# Altium schematic sheet 5-Brake Temp Sensors.SchDoc
size A4
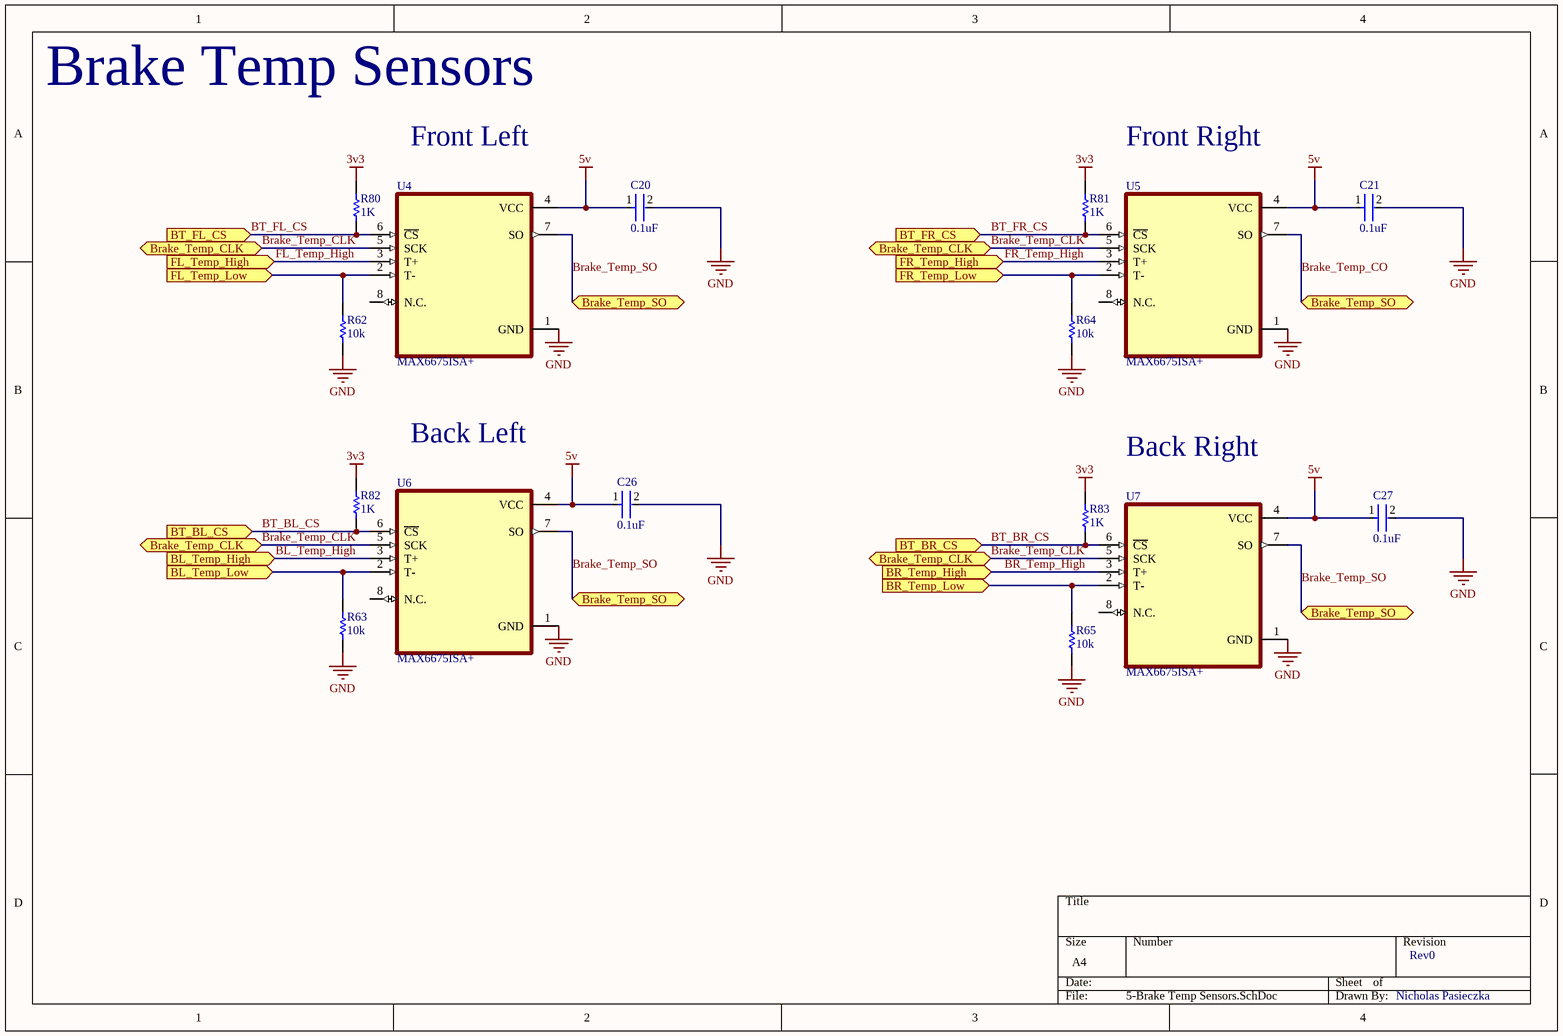
[diagram p0: 5-Brake Temp Sensors.SchDoc]

## Parts
C20  0.1uF  [FP-CL17-IPC_C]
C21  0.1uF  [FP-CL17-IPC_C]
C26  0.1uF  [FP-CL17-IPC_C]
C27  0.1uF  [FP-CL17-IPC_C]
R62  value 10k  [1608[0603]]  (hidden comment: Res1)
R63  value 10k  [1608[0603]]  (hidden comment: Res1)
R64  value 10k  [1608[0603]]  (hidden comment: Res1)
R65  value 10k  [1608[0603]]  (hidden comment: Res1)
R80  value 1K  [1608[0603]]  (hidden comment: Res1)
R81  value 1K  [1608[0603]]  (hidden comment: Res1)
R82  value 1K  [1608[0603]]  (hidden comment: Res1)
R83  value 1K  [1608[0603]]  (hidden comment: Res1)
U4  MAX6675ISA+  [SOIC127P600X175-8N]
U5  MAX6675ISA+  [SOIC127P600X175-8N]
U6  MAX6675ISA+  [SOIC127P600X175-8N]
U7  MAX6675ISA+  [SOIC127P600X175-8N]

## Ports
BL_Temp_High (in), BL_Temp_Low (in), BR_Temp_High (in), BR_Temp_Low (in), Brake_Temp_CLK (bidir), Brake_Temp_SO (bidir), BT_BL_CS (in), BT_BR_CS (in), BT_FL_CS (in), BT_FR_CS (in), FL_Temp_High (in), FL_Temp_Low (in), FR_Temp_High (in), FR_Temp_Low (in)

## Nets
3v3: R80.2 R81.2 R82.2 R83.2
5v: C20.1 C21.1 C26.1 C27.1 U4.4(VCC) U5.4(VCC) U6.4(VCC) U7.4(VCC)
GND: C20.2 C21.2 C26.2 C27.2 R62.1 R63.1 R64.1 R65.1 U4.1(GND) U5.1(GND) U6.1(GND) U7.1(GND)
BL_Temp_High: U6.3(T+) ; port BL_Temp_High
BL_Temp_Low: R63.2 U6.2(T-) ; port BL_Temp_Low
BR_Temp_High: U7.3(T+) ; port BR_Temp_High
BR_Temp_Low: R65.2 U7.2(T-) ; port BR_Temp_Low
Brake_Temp_CLK: U4.5(SCK) U5.5(SCK) U6.5(SCK) U7.5(SCK) ; port Brake_Temp_CLK
Brake_Temp_CO: U4.7(SO) U5.7(SO) U6.7(SO) U7.7(SO) ; port Brake_Temp_SO  [also labelled Brake_Temp_SO]
BT_BL_CS: R82.1 U6.6(~{CS}) ; port BT_BL_CS
BT_BR_CS: R83.1 U7.6(~{CS}) ; port BT_BR_CS
BT_FL_CS: R80.1 U4.6(~{CS}) ; port BT_FL_CS
BT_FR_CS: R81.1 U5.6(~{CS}) ; port BT_FR_CS
FL_Temp_High: U4.3(T+) ; port FL_Temp_High
FL_Temp_Low: R62.2 U4.2(T-) ; port FL_Temp_Low
FR_Temp_High: U5.3(T+) ; port FR_Temp_High
FR_Temp_Low: R64.2 U5.2(T-) ; port FR_Temp_Low

Not connected (* = marked no-connect by the designer): U4 8(N.C.); U5 8(N.C.); U6 8(N.C.); U7 8(N.C.)

## Notes on the sheet
- Brake Temp Sensors
- Front Left
- Front Right
- Back Left
- Back Right
- Rev0
- Nicholas Pasieczka

## Library data of the parts
C20 C21 C26 C27 = CMP-13271-001069-1: Cap Ceramic 100nF 10V X7R ±10% SMD 0402 +125°C Paper T/R; Height: 0.5mm; Case/Package: 0402; Contact Plating: Tin; Case Code (Imperial): 0402; Capacitance: 100nF; Thickness: 0.022inch; Min Operating Temperature: -55°C; Package Quantity: 1; Length: 1mm; Max Operating Temperature: 125°C; Depth: 0.5mm; Voltage Rating: 10V; Packaging: Tape and Reel; Mount: Surface Mount; Tolerance: 10%; Width: 0.02inch; Radiation Hardening: No; Case Code (Metric): 1005; Dielectric: X7R
R62-R65 = Res1: Resistor; Manufacturer: Yageo; Manufacturer Part Number: RC0603JR-0710KL; Tolerance: ±5%; Power (Watts): 0.1W, 1/10W; Temperature Coefficient: ±100ppm/°C; Supplier 1: Digi-Key; Supplier Part Number 1: 311-10KGRCT-ND; RoHS: RoHS Compliant; Category: Resistors; Stock 1: 2936292; Pricing 1: 1=0.16, 10=0.016, 25=0.0112, 50=0.0084, 100=0.0062, 250=0.0048, 500=0.00382, 1000=0.00281 (CAD); Packaging: Cut Tape (CT); Part Status: Active; Resistance (Ohms): 10k; Composition: Thick Film; Features: Moisture Resistant; Operating Temperature: -55°C ~ 155°C; Package / Case: 0603 (1608 Metric); Supplier Device Package: 0603; Size / Dimension: 0.063" L x 0.031" W (1.60mm x 0.80mm); Height - Seated (Max): 0.022" (0.55mm); Number of Terminations: 2; Failure Rate: -; ComponentLink1URL: http://www.yageo.com/NewPortal/yageodocoutput?fileName=/pdf/R-Chip/PYu-RC_Group_51_RoHS_L_4.pdf; ComponentLink1Description: http://www.yageo.com/NewPortal/yageodocoutput?fileName=/pdf/R-Chip/PYu-RC_Group_51_RoHS_L_4.pdf
R80-R83 = Res1: Resistor; Published: 8-Jun-2000; LatestRevisionDate: 17-Jul-2002; LatestRevisionNote: Re-released for DXP Platform.; PackageReference: AXIAL-0.3; Publisher: Altium Limited; PackageDescription: Axial Device, Thru-Hole; 2 Leads; 0.3 in Pin Spacing
U4-U7 = MAX6675ISA+: IC THERMOCOUP TO DGTL 8-SOIC; MF: Maxim Integrated; Package: SOIC-8 Maxim; Price: None; SnapEDA_Link: https://www.snapeda.com/parts/MAX6675ISA%2B/Maxim%20Integrated/view-part/213937/?ref=snap; Availability: Unavailable; Value: *; MP: MAX6675ISA+